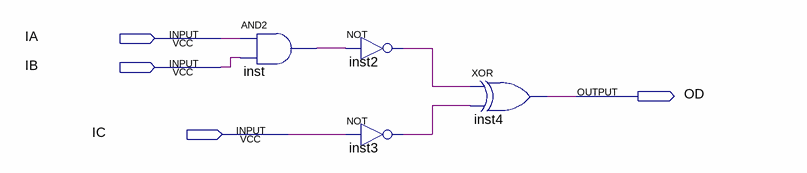
[diagram p0: schematic sheet]
// Quartus schematic CKTO_4.bdf as structural Verilog: 4 symbols, 4 pins
module CKTO_4 (
  input  IA,
  input  IB,
  input  IC,
  output OD
);

  wire inst2_out, inst3_out, inst_out;

  and inst (inst_out, IA, IB);
  not inst2 (inst2_out, inst_out);
  not inst3 (inst3_out, IC);
  xor inst4 (OD, inst2_out, inst3_out);
endmodule
